# EasyEDA Pro project TDX_Pro_touchsubboard_1.1.epro

# Board PCB3_1
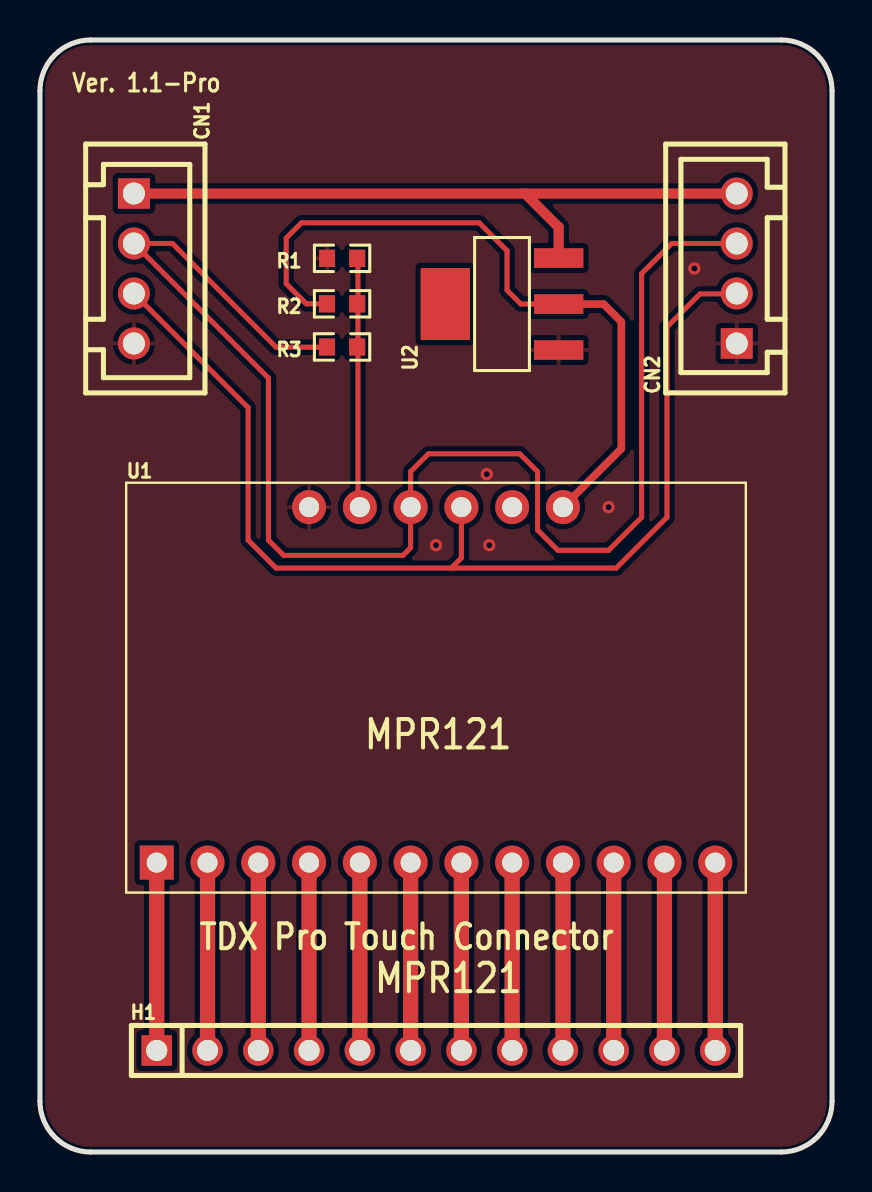
[diagram p0: board, top side]
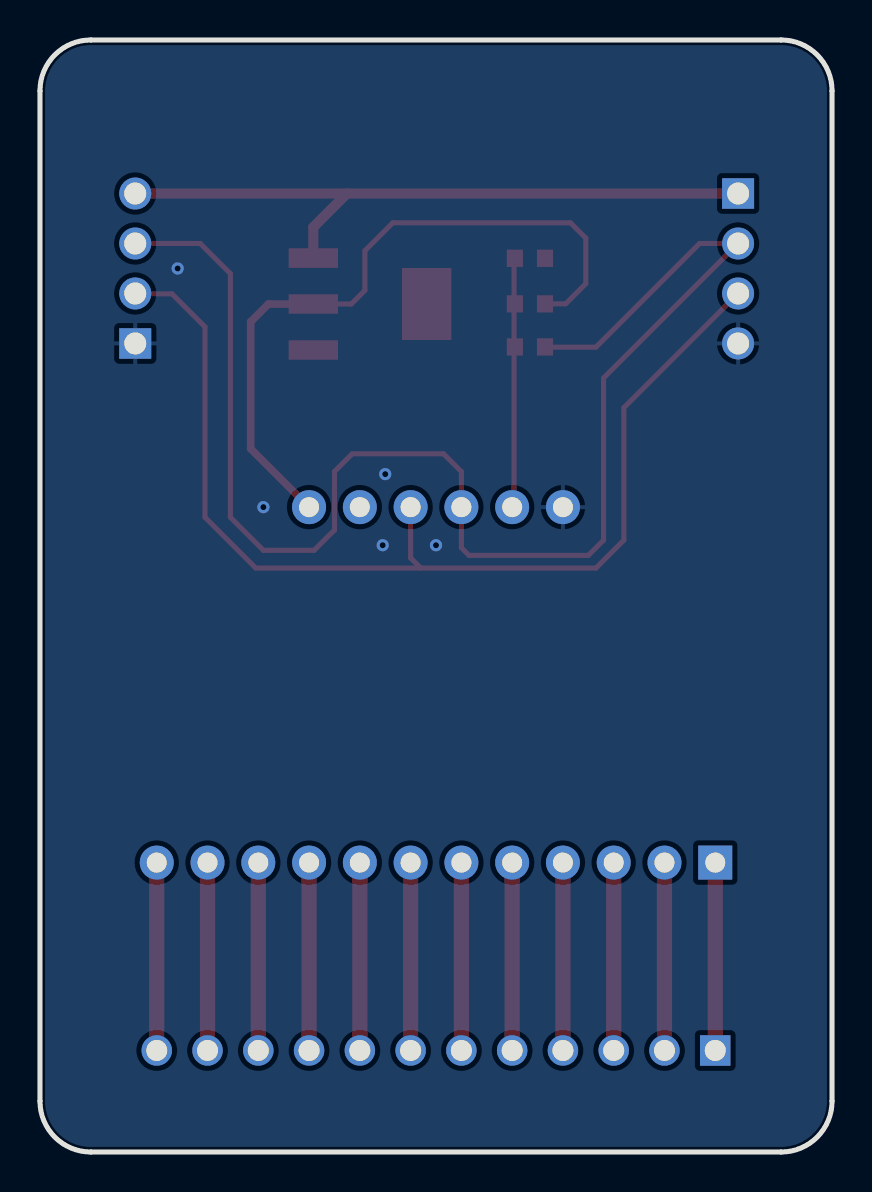
[diagram p1: board, bottom side, seen from below]

Outline 39.62 x 55.63 mm; copper layers: Top Layer, Bottom Layer. Coordinates in mm from the lower left corner of the outline.
Outline path: 0,53.09 0,2.54 arc(0.74,0.74) 2.54,0 37.08,0 arc(38.88,0.74) 39.62,2.54 39.62,53.09 arc(38.88,54.88) 37.08,55.63 2.54,55.63 arc(0.74,54.88) 0,53.09
Stack: Top Layer 0.035mm / Dielectric1 1.51mm FR4 er 4.5 / Bottom Layer 0.035mm

## Design rules (mm)
template: JLCPCB Capability(Two Layers Board)
spacing copperThickness1oz (default): track to track 0.102, other pairs 0.152 to 0.3
spacing copperThickness2oz: track to track 0.203, other pairs 0.152 to 0.3
track width copperThickness1oz (default): min 0.127, default 0.254, max 2.54
track width copperThickness2oz: min 0.203, default 0.254, max 2.54
differential pair differentialPair (default): width min 0.127, default 0.254, max 2.54; gap min 0.152, default 0.152
via viaSize (default): diameter min 0.5, default 0.61, max 10; hole min 0.3, default 0.305, max 6.3

## Placement (name value [footprint] x y rotation side)
CN1  ZX-XH2.54-4PZZ  [CONN-TH_4P-P2.50_4PIN]  4.7 44.2 270 top
CN2  ZX-XH2.54-4PZZ  [CONN-TH_4P-P2.50_4PIN]  34.86 44.2 90 top
H1  PZ254V-11-12P  [HDR-TH_12P-P2.54-V-M]  19.81 5.08 0 top
R1  0Ω  [R0603]  15.11 44.7 0 top
R2  0Ω  [R0603]  15.11 42.43 0 top
R3  0Ω  [R0603]  15.11 40.27 0 top
U1  -  [mai_io:MPR121_BOARD]  19.81 14.48 0 top
U2  AMS1117-3.3V  [SOT-223-4_L6.5-W3.5-P2.30-LS7.0-TR]  23.11 42.42 90 top

## Footprints (pads in the part's own frame, mm; a bottom-side part is the same pattern mirrored in y, then rotated)
CONN-TH_4P-P2.50_4PIN
  rect 1.524x1.6 hole 1.1: 1(-3.75,0)
  round 1.6 hole 1.1: 2(-1.25,0) 3(1.25,0) 4(3.75,0)
HDR-TH_12P-P2.54-V-M
  rect 1.524x1.524 hole 1.05: 1(-13.97,0)
  round 1.524 hole 1.05: 2(-11.43,0) 3(-8.89,0) 4(-6.35,0) 5(-3.81,0) 6(-1.27,0) 7(1.27,0) 8(3.81,0) 9(6.35,0) 10(8.89,0) 11(11.43,0) 12(13.97,0)
mai_io:MPR121_BOARD
  round 1.7 hole 1: 1(3.81,17.78) 2(1.27,17.78) 3(-1.27,17.78) 4(-3.81,17.78) 6(-6.35,17.78) 9(-11.43,0) 10(-8.89,0) 11(-6.35,0) 12(-3.81,0) 13(-1.27,0) 14(1.27,0) 15(3.81,0) 16(6.35,0) 17(8.89,0) 18(11.43,0) 19(13.97,0) 20(6.35,17.78)
  rect 1.7x1.7 hole 1: 8(-13.97,0)
R0603
  rect 0.806x0.864 smd: 1(-0.753,0) 2(0.753,0)
SOT-223-4_L6.5-W3.5-P2.30-LS7.0-TR
  rect 0.98x2.47 smd: 1(-2.3,-2.835) 2(0,-2.835) 3(2.3,-2.835)
  rect 3.6x2.47 smd: 4(0,2.835)

## Nets
+3V3: R2.1 U1.20 U2.2
+5V: CN1.1 CN2.4 U2.3
GND: CN1.4 CN2.1 R1.1 U1.6 U2.1
ADDRESS_SWITCH: R1.2 R2.2 R3.2 U1.4
SCL: CN1.3 CN2.2 U1.2
SDA: CN1.2 CN2.3 R3.1 U1.3
TOUCH_1: H1.1 U1.8
TOUCH_2: H1.2 U1.9
TOUCH_3: H1.3 U1.10
TOUCH_4: H1.4 U1.11
TOUCH_5: H1.5 U1.12
TOUCH_6: H1.6 U1.13
TOUCH_7: H1.7 U1.14
TOUCH_8: H1.8 U1.15
TOUCH_9: H1.9 U1.16
TOUCH_10: H1.10 U1.17
TOUCH_11: H1.11 U1.18
TOUCH_12: H1.12 U1.19

Pads without a net: U1 1; U2 4

## Via types
v1: diameter 0.61, hole 0.305, Top Layer to Bottom Layer, 5 vias

## Routing (per net, layer and track width the routed paths; a pad name or vN(x,y) marks a point on that pad's centre or on a via; arc(x,y) is an arc through that point)
GND:
  vias: v1(19.81,30.35) v1(22.35,33.91) v1(22.48,30.35) v1(28.45,32.26) v1(32.74,44.2)
+3V3: length 35.5
  Top Layer w0.254: 14.32,42.43 13.33,42.43 12.32,43.43 12.32,45.72 13.08,46.48 21.97,46.48 23.37,45.09 23.37,43.1 24.05,42.42 U2.2
  Top Layer w0.381: U2.2 28.19,42.42 29.08,41.53 29.08,35.18 U1.20
+5V: length 34.1
  Top Layer w0.508: CN1.1 CN2.4 ; 24.27,47.95 25.95,46.26 U2.3
ADDRESS_SWITCH: length 12.5
  Top Layer w0.254: 15.91,44.7 15.91,32.35 U1.4
SCL: length 54.3
  Top Layer w0.254: CN1.3 10.41,37.23 10.41,30.61 11.81,29.21 20.57,29.21 ; 20.57,29.21 21.08,29.72 U1.2 ; 20.57,29.21 28.83,29.21 31.37,31.75 31.37,41.28 33.02,42.93 34.84,42.93 CN2.2
SDA: length 74.7
  Top Layer w0.254: 14.32,40.26 11.81,40.26 6.62,45.45 CN1.2 11.43,38.72 11.43,30.61 12.19,29.85 18.16,29.85 18.54,30.23 U1.3 18.54,34.04 19.43,34.93 24,34.93 24.89,34.04 24.89,31.12 25.91,30.1 28.45,30.1 30.1,31.75 30.1,43.94 31.6,45.45 CN2.3
TOUCH_1: length 9.4
  Top Layer w0.762: U1.8 H1.1
TOUCH_2: length 9.4
  Top Layer w0.762: U1.9 H1.2
TOUCH_3: length 9.4
  Top Layer w0.762: U1.10 H1.3
TOUCH_4: length 9.4
  Top Layer w0.762: U1.11 H1.4
TOUCH_5: length 9.4
  Top Layer w0.762: U1.12 H1.5
TOUCH_6: length 9.4
  Top Layer w0.762: U1.13 H1.6
TOUCH_7: length 9.4
  Top Layer w0.762: U1.14 H1.7
TOUCH_8: length 9.4
  Top Layer w0.762: U1.15 H1.8
TOUCH_9: length 9.4
  Top Layer w0.762: U1.16 H1.9
TOUCH_10: length 9.4
  Top Layer w0.762: U1.17 H1.10
TOUCH_11: length 9.4
  Top Layer w0.762: U1.18 H1.11
TOUCH_12: length 9.4
  Top Layer w0.762: U1.19 H1.12

## Copper pours and planes (outline as drawn; the poured copper is in the pictures)
GND on Top Layer: -0.76,56.26 40.51,56.26 40.51,-0.51 -0.76,-0.51
GND on Bottom Layer: -0.63,56.13 40.26,56.13 40.26,-0.38 -0.63,-0.38

## Text on the board
Top Silkscreen Layer: Ver. 1.1-Pro | TDX Pro Touch Connector | MPR121
